# EAGLE design incubatorShield (EAGLE 8.5.1)
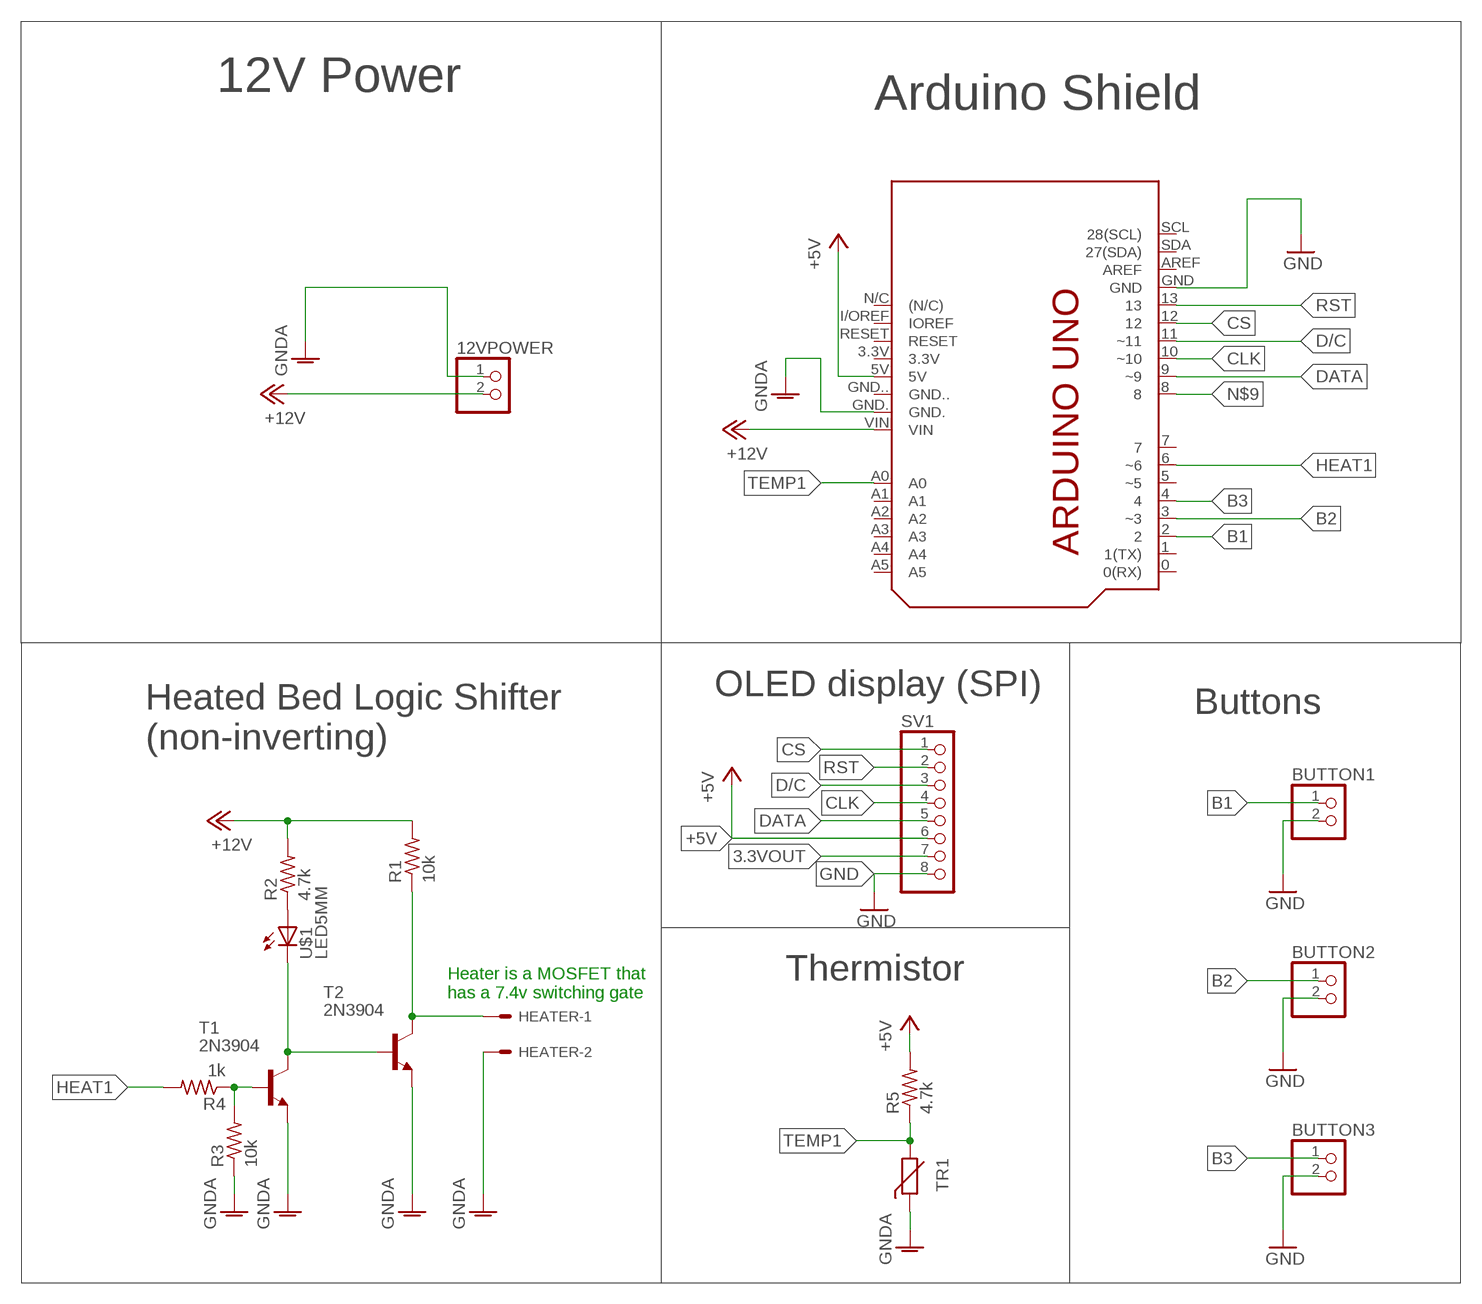
[diagram p0: schematic, sheet 1]

## Parts
12VPOWER  PINHD-1X2  [1X02]
BUTTON1  PINHD-1X2  [1X02]
BUTTON2  PINHD-1X2  [1X02]
BUTTON3  PINHD-1X2  [1X02]
HEATER  KK-156-2  [KK-156-2]
R1  10k  R-US_0309/12  [0309/12]
R2  4.7k  R-US_0309/12  [0309/12]
R3  10k  R-US_0309/12  [0309/12]
R4  1k  R-US_0309/12  [0309/12]
R5  4.7k  R-US_0309/12  [0309/12]
SV1  PINHD-1X8  [1X08]
T1  2N3904  [TO92]
T2  2N3904  [TO92]
TR1  THERMISTOR_R-2,5  [RS-2,5]
U$1  LED5MM  [5MM]
U$2  ARDUINO_UNO_UNBOUND  [ARDUINO_UNO_UNBOUND]

## Nets
3.3VOUT: SV1.7
+5V: R5.2 SV1.6 U$2.5V
+12V: 12VPOWER.2 R1.2 R2.2 U$2.VIN
B1: BUTTON1.1 U$2.2
B2: BUTTON2.1 U$2.3(~3)
B3: BUTTON3.1 U$2.4
CLK: SV1.4 U$2.10(~10)
CS: SV1.1 U$2.12
D/C: SV1.3 U$2.11(~11)
DATA: SV1.5 U$2.9(~9)
GND: BUTTON1.2 BUTTON2.2 BUTTON3.2 SV1.8 U$2.GND
GNDA: 12VPOWER.1 HEATER.2 R3.1 T1.3(E) T2.3(E) TR1.1 U$2.GND.
HEAT1: R4.2 U$2.6(~6)
HEATER_LOGIC: HEATER.1 R1.1 T2.1(C)
N$1: T1.1(C) T2.2(B) U$1.OUT(C)
N$3: R3.2 R4.1 T1.2(B)
N$4: R2.1 U$1.IN(A)
N$9: U$2.8
RST: SV1.2 U$2.13
TEMP1: R5.1 TR1.2 U$2.A0
Unconnected: U$2.0(0(RX)) U$2.1(1(TX)) U$2.3.3V U$2.5(~5) U$2.7 U$2.A1 U$2.A2 U$2.A3 U$2.A4 U$2.A5 U$2.AREF U$2.GND.. U$2.I/OREF(IOREF) U$2.N/C((N/C)) U$2.RESET U$2.SCL(28(SCL)) U$2.SDA(27(SDA))

## Notes on the sheet
- 12V Power
- Arduino Shield
- OLED display (SPI)
- Buttons
- Heated Bed Logic Shifter
  (non-inverting)
- Thermistor
- Heater is a MOSFET that
  has a 7.4v switching gate

## Library data of the parts
12VPOWER BUTTON1-BUTTON3 = pinhead:PINHD-1X2: PIN HEADER
HEATER = con-molex:KK-156-2: KK 156 HEADER Source: http://www.molex.com/pdm_docs/sd/026604100_sd.pdf; MF: MOLEX; OC_FARNELL: unknown; OC_NEWARK: unknown
R1-R5 = rcl:R-US_: RESISTOR, American symbol; SPICEPREFIX: R
SV1 = pinhead:PINHD-1X8: PIN HEADER
T1 T2 = transistor:2N3904: NPN TRANSISTOR
TR1 = discrete:THERMISTOR_: Thermo Resistor
U$1 = fab:LED: LED
U$2 = Arduino:ARDUINO_UNO_UNBOUND

## Board
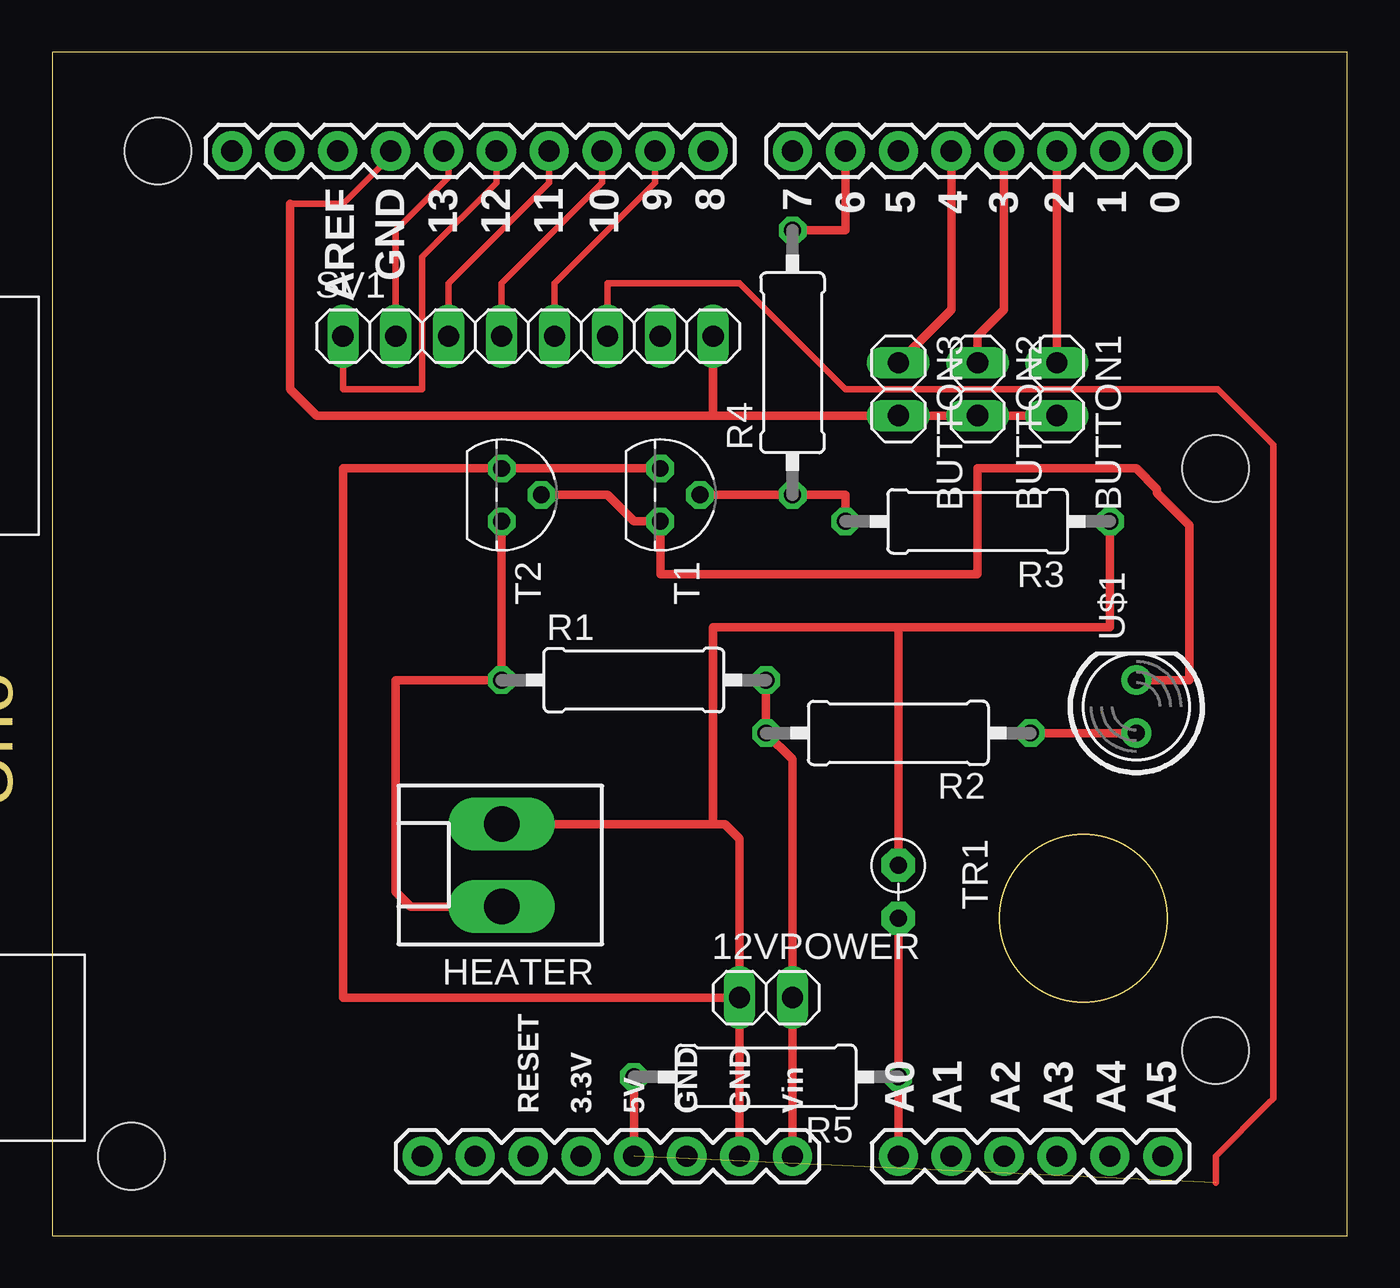
[diagram p1: board, top side]

Size 62.21 x 56.82 mm. Coordinates in mm from the lower left corner, seen from the top.
Outline: 0,0 62.21,0 62.21,56.82 0,56.82 0,0
Outline: circle at 49.53,15.24 radius 4.02
Copper layers (1*16): Top 0.035mm / dielectric 1.5mm / Bottom 0.035mm
Design rules "default": minimum track width 6mil, minimum drill 0.35mm, track to track 6mil, track to pad 6mil, pad to pad 6mil, via to via 6mil, smd to smd 6mil, copper to edge 40mil, drill to drill 6mil, minimum pad ring 10mil, minimum via ring 8mil, stop-mask expansion 4mil, vias tented up to drill 0mil, thermal gap 10mil

### Footprints (pad centres in the part's own frame; a part is rotated, then mirrored left to right if it is on the bottom)
1X02 = drill 1.016 long: 1 -1.27,0; 2 1.27,0
KK-156-2 = drill 1.7 pad 2.184 long: 1 -1.98,0; 2 1.98,0
0309/12 = drill 0.813 octagon: 1 -6.35,0; 2 6.35,0
1X08 = drill 1.016 long: 1 -8.89,0; 2 -6.35,0; 3 -3.81,0; 4 -1.27,0; 5 1.27,0; 6 3.81,0; 7 6.35,0; 8 8.89,0
TO92 = drill 0.813 octagon: 1 1.27,0; 2 0,1.905; 3 -1.27,0
RS-2,5 = drill 0.813 pad 1.6 octagon: 1 -1.27,0; 2 1.27,0
5MM = drill 0.813 pad 1.422: IN -1.27,0; OUT 1.27,0
ARDUINO_UNO_UNBOUND = drill 1.016 pad 1.88: 0 63.5,50.8; 1 60.96,50.8; 2 58.42,50.8; 3 55.88,50.8; 3.3V 35.56,2.54; 4 53.34,50.8; 5 50.8,50.8; 5V 38.1,2.54; 6 48.26,50.8; 7 45.72,50.8; 8 41.656,50.8; 9 39.116,50.8; 10 36.576,50.8; 11 34.036,50.8; 12 31.496,50.8; 13 28.956,50.8; A0 50.8,2.54; A1 53.34,2.54; A2 55.88,2.54; A3 58.42,2.54; A4 60.96,2.54; A5 63.5,2.54; AREF 23.876,50.8; GND 26.416,50.8; GND. 43.18,2.54; GND.. 40.64,2.54; I/OREF 30.48,2.54; N/C 27.94,2.54; RESET 33.02,2.54; SCL 18.796,50.8; SDA 21.336,50.8; VIN 45.72,2.54 | hole 3.2: 66.04,7.62; 66.04,35.56; 15.24,50.8; 13.97,2.54

### Placement (x,y rotation side)
12VPOWER  34.29,11.43 0 top
BUTTON1  48.26,40.64 270 top
BUTTON2  44.45,40.64 270 top
BUTTON3  40.64,40.64 270 top
HEATER  21.59,17.78 90 top
R1  27.94,26.67 0 top
R2  40.64,24.13 180 top
R3  44.45,34.29 180 top
R4  35.56,41.91 90 top
R5  34.29,7.62 180 top
SV1  22.86,43.18 0 top
T1  29.21,35.56 270 top
T2  21.59,35.56 270 top
TR1  40.64,16.51 270 top
U$1  52.07,25.4 90 top
U$2  -10.16,1.27 0 top

### Tracks (layer width: path | path; a pad name or v marks a point on that pad's centre or on a via)
+5V  (1 unrouted)
  Top 0.305: SV1.6 26.67,45.72 33.02,45.72 38.1,40.64 55.98,40.64 58.65,37.98 58.65,36.83 58.65,6.58 58.42,6.35 55.88,3.81 55.88,2.54
  Top 0.406: U$2.5V R5.2
+12V
  Top 0.406: U$2.VIN 12VPOWER.2 35.56,22.86 R2.2 R1.2
B1
  Top 0.406: BUTTON1.1 U$2.2
B2
  Top 0.406: BUTTON2.1 44.45,43.18 45.72,44.45 U$2.3
B3
  Top 0.406: BUTTON3.1 43.18,44.45 U$2.4
CLK
  Top 0.305: SV1.4 21.59,45.72 26.42,50.55 U$2.10
CS
  Top 0.305: SV1.1 13.97,40.64 17.78,40.64 17.78,46.99 21.34,50.55 U$2.12
D/C
  Top 0.305: SV1.3 19.05,45.72 23.88,50.55 U$2.11
DATA
  Top 0.305: SV1.5 24.13,45.72 28.96,50.55 U$2.9
GND
  Top 0.305: 11.43,49.53 13.97,49.53 16.26,51.82 U$2.GND
  Top 0.406: BUTTON1.2 BUTTON2.2 BUTTON3.2 31.75,39.37 | 31.75,39.37 12.7,39.37 11.43,40.64 11.43,49.53 | 16.51,51.82 U$2.GND | SV1.8 31.75,39.37
GNDA
  Top 0.406: 12VPOWER.1 U$2.GND. | 12VPOWER.1 33.02,19.05 32.31,19.76 31.75,19.76 | 31.75,19.76 HEATER.2 | 31.75,19.76 31.75,29.21 40.64,29.21 | 40.64,29.21 TR1.1 | 40.64,29.21 50.8,29.21 R3.1 | T1.3 T2.3 13.97,36.83 13.97,11.43 12VPOWER.1
HEAT1
  Top 0.406: R4.2 38.1,48.26 U$2.6
HEATER_LOGIC
  Top 0.406: T2.1 R1.1 16.51,26.67 16.51,16.51 17.22,15.8 HEATER.1
N$1
  Top 0.406: U$1.OUT 54.61,26.67 54.61,34.11 53.06,35.66 53.06,35.84 52.07,36.83 44.45,36.83 44.45,31.75 29.21,31.75 T1.1 27.94,34.29 26.67,35.56 T2.2
N$3
  Top 0.406: R3.2 38.1,35.56 R4.1 T1.2
N$4
  Top 0.406: R2.1 U$1.IN
RST
  Top 0.305: SV1.2 16.51,48.26 19.05,50.8 19.05,51.82 U$2.13
TEMP1
  Top 0.406: TR1.2 R5.1 U$2.A0